# EAGLE schematic Circlez8a (EAGLE 6.3)
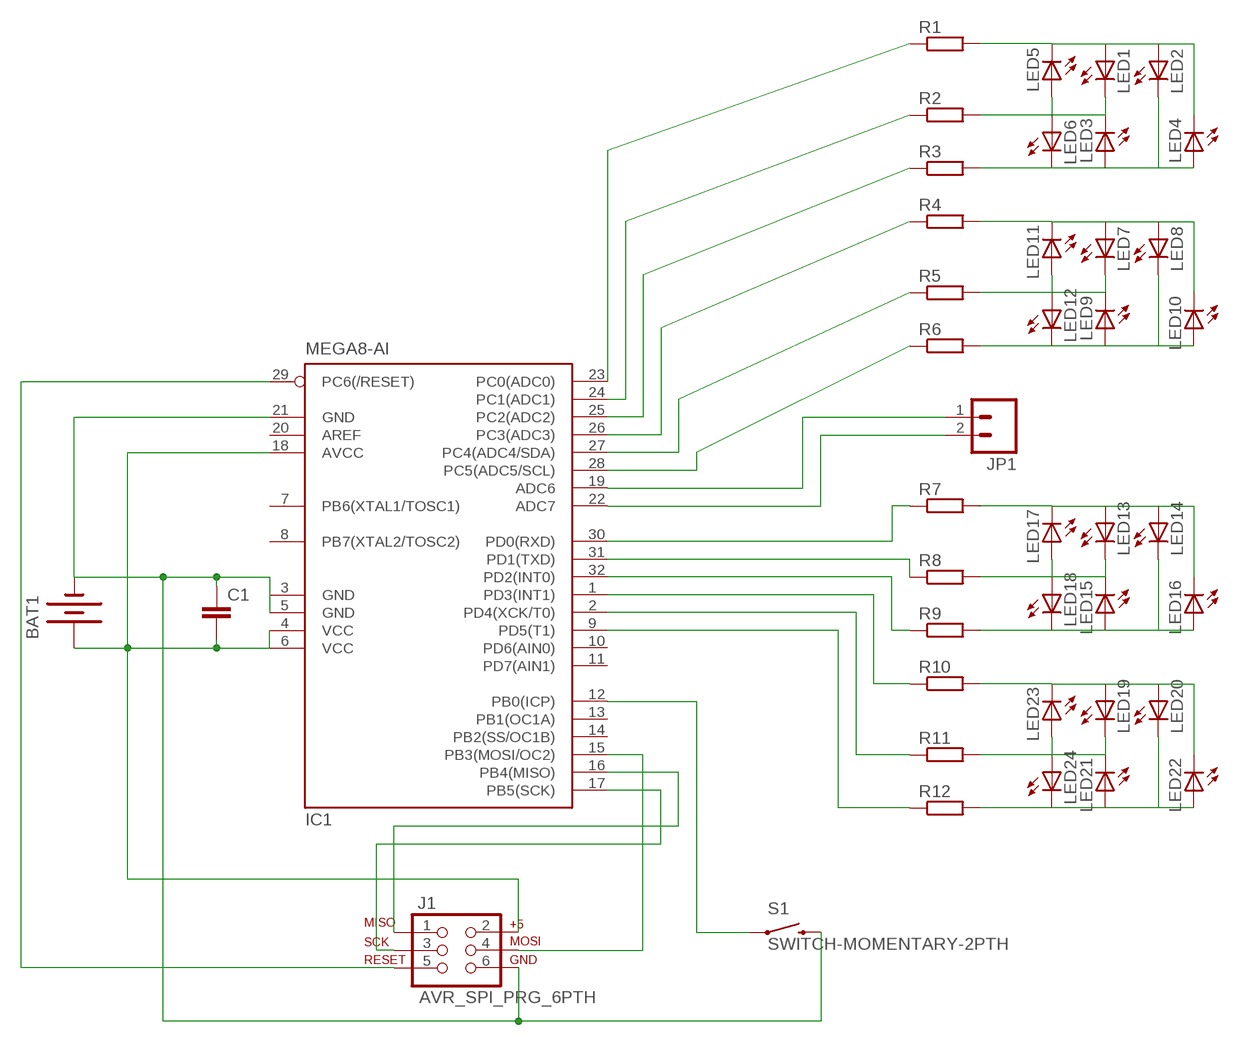
[diagram p0: schematic, sheet 1]

## Parts
BAT1  BATTERY20PTH  [BATTCOM_20MM_PTH]
C1  C-EU025-024X044  [C025-024X044]
IC1  MEGA8-AI  [TQFP32-08]
J1  AVR_SPI_PRG_6PTH  [2X3]
JP1  M02PTH  [1X02]
LED1  LEDCHIPLED_0603  [CHIPLED_0603]
LED2  LEDCHIPLED_0603  [CHIPLED_0603]
LED3  LEDCHIPLED_0603  [CHIPLED_0603]
LED4  LEDCHIPLED_0603  [CHIPLED_0603]
LED5  LEDCHIPLED_0603  [CHIPLED_0603]
LED6  LEDCHIPLED_0603  [CHIPLED_0603]
LED7  LEDCHIPLED_0603  [CHIPLED_0603]
LED8  LEDCHIPLED_0603  [CHIPLED_0603]
LED9  LEDCHIPLED_0603  [CHIPLED_0603]
LED10  LEDCHIPLED_0603  [CHIPLED_0603]
LED11  LEDCHIPLED_0603  [CHIPLED_0603]
LED12  LEDCHIPLED_0603  [CHIPLED_0603]
LED13  LEDCHIPLED_0603  [CHIPLED_0603]
LED14  LEDCHIPLED_0603  [CHIPLED_0603]
LED15  LEDCHIPLED_0603  [CHIPLED_0603]
LED16  LEDCHIPLED_0603  [CHIPLED_0603]
LED17  LEDCHIPLED_0603  [CHIPLED_0603]
LED18  LEDCHIPLED_0603  [CHIPLED_0603]
LED19  LEDCHIPLED_0603  [CHIPLED_0603]
LED20  LEDCHIPLED_0603  [CHIPLED_0603]
LED21  LEDCHIPLED_0603  [CHIPLED_0603]
LED22  LEDCHIPLED_0603  [CHIPLED_0603]
LED23  LEDCHIPLED_0603  [CHIPLED_0603]
LED24  LEDCHIPLED_0603  [CHIPLED_0603]
R1  R-EU_R1206  [R1206]
R2  R-EU_R1206  [R1206]
R3  R-EU_R1206  [R1206]
R4  R-EU_R1206  [R1206]
R5  R-EU_R1206  [R1206]
R6  R-EU_R1206  [R1206]
R7  R-EU_R1206  [R1206]
R8  R-EU_R1206  [R1206]
R9  R-EU_R1206  [R1206]
R10  R-EU_R1206  [R1206]
R11  R-EU_R1206  [R1206]
R12  R-EU_R1206  [R1206]
S1  SWITCH-MOMENTARY-2PTH  [TACTILE-PTH]

## Nets
GND: BAT1.2(-) C1.1 IC1.3(GND) IC1.5(GND) IC1.21(GND) J1.6 S1.3
N$1: IC1.12(PB0(ICP)) S1.1
N$3: IC1.16(PB4(MISO)) J1.1
N$4: IC1.17(PB5(SCK)) J1.3
N$5: IC1.15(PB3(MOSI/OC2)) J1.4
N$6: IC1.29(PC6(/RESET)) J1.5
N$9: LED1.A LED2.A LED4.C LED5.C R1.2
N$10: LED2.C LED3.A LED4.A LED6.C R3.2
N$11: LED1.C LED3.C LED5.A LED6.A R2.2
N$12: IC1.22(ADC7) JP1.2
N$13: LED7.A LED8.A LED10.C LED11.C R4.2
N$14: LED8.C LED9.A LED10.A LED12.C R6.2
N$15: LED7.C LED9.C LED11.A LED12.A R5.2
N$16: LED13.A LED14.A LED16.C LED17.C R7.2
N$17: LED14.C LED15.A LED16.A LED18.C R9.2
N$18: LED13.C LED15.C LED17.A LED18.A R8.2
N$19: LED19.A LED20.A LED22.C LED23.C R10.2
N$20: LED20.C LED21.A LED22.A LED24.C R12.2
N$21: LED19.C LED21.C LED23.A LED24.A R11.2
N$22: IC1.23(PC0(ADC0)) R1.1
N$23: IC1.24(PC1(ADC1)) R2.1
N$24: IC1.25(PC2(ADC2)) R3.1
N$25: IC1.26(PC3(ADC3)) R4.1
N$26: IC1.27(PC4(ADC4/SDA)) R5.1
N$27: IC1.28(PC5(ADC5/SCL)) R6.1
N$28: IC1.30(PD0(RXD)) R7.1
N$29: IC1.31(PD1(TXD)) R8.1
N$30: IC1.32(PD2(INT0)) R9.1
N$31: IC1.1(PD3(INT1)) R10.1
N$32: IC1.2(PD4(XCK/T0)) R11.1
N$33: IC1.9(PD5(T1)) R12.1
N$34: IC1.19(ADC6) JP1.1
VCC: BAT1.1(+) C1.2 IC1.4(VCC) IC1.6(VCC) IC1.18(AVCC) J1.2
Unconnected: IC1.7(PB6(XTAL1/TOSC1)) IC1.8(PB7(XTAL2/TOSC2)) IC1.10(PD6(AIN0)) IC1.11(PD7(AIN1)) IC1.13(PB1(OC1A)) IC1.14(PB2(SS/OC1B)) IC1.20(AREF)

## Library data of the parts
BAT1 = SparkFun:BATTERY: Battery Holders Various common sizes : AA, AAA, 20mm coin cell and 12mm coin cell.
C1 = resistor:C-EU: CAPACITOR, European symbol
IC1 = atmel:MEGA8: MICROCONTROLLER 8 Kbytes FLASH, 1 kbytes SRAM, 512 bytes EEPROM, USART, 6-channel 10 bit ADC, 2-channel 8 bit ADC Pin compatible with Atmega48, ATMega88, ATMega168 Source: avr.lbr; MPN: ATMEGA8-16AU; OC_FARNELL: 9171371; OC_NEWARK: 73M8863
J1 = SparkFun-Connectors:AVR_SPI_PRG_6: AVR ISP 6 Pin This is the reduced ISP connector for AVR programming. Common on Arduino. This footprint will take up less PCB space and can be used with a 10-pin to 6-pin adapter such as SKU: BOB-08508
JP1 = SparkFun-Connectors:M02: Header 2 Standard 2-pin 0.1" header. Use with straight break away headers (SKU : PRT-00116), right angle break away headers (PRT-00553), swiss pins (PRT-00743), machine pins (PRT-00117), and female headers (PRT-00115). Molex polarized connector foot print use with SKU : PRT-08233 with associated crimp pins and housings.
LED1-LED24 = led:LED: LED OSRAM: - CHIPLED LG R971, LG N971, LY N971, LG Q971, LY Q971, LO R971, LY R971 LH N974, LH R974 LS Q976, LO Q976, LY Q976 LO Q996 - Hyper CHIPLED LW Q18S LB Q993, LB Q99A, LB R99A - SideLED LS A670, LO A670, LY A670, LG A670, LP A670 LB A673, LV A673, LT A673, LW A673 LH A674 LY A675 LS A676, LA A676, LO A676, LY A676, LW A676 LS A679, LY A679, LG A679 - Hyper Micro SIDELED® LS Y876, LA Y876, LO Y876, LY Y876 LT Y87S - SmartLED LW L88C, LW L88S LB L89C, LB L89S, LG L890 LS L89K, LO L89K, LY L89K LS L896, LA L896, LO L896, LY L896 - TOPLED LS T670, LO T670, LY T670, LG T670, LP T670 LSG T670, LSP T670, LSY T670, LOP T670, LYG T670 LG T671, LOG T671, LSG T671 LB T673, LV T673, LT T673, LW T673 LH T674 LS T676, LA T676, LO T676, LY T676, LB T676, LH T676, LSB T676, LW T676 LB T67C, LV T67C, LT T67C, LS T67K, LO T67K, LY T67K, LW E67C LS E67B, LA E67B, LO E67B, LY E67B, LB E67C, LV E67C, LT E67C LW T67C LS T679, LY T679, LG T679 LS T770, LO T770, LY T770, LG T770, LP T770 LB T773, LV T773, LT T773, LW T773 LH T774 LS E675, LA E675, LY E675, LS T675 LS T776, LA T776, LO T776, LY T776, LB T776 LHGB T686 LT T68C, LB T68C - Hyper Mini TOPLED® LB M676 - Mini TOPLED Santana® LG M470 LS M47K, LO M47K, LY M47K Source: http://www.osram.convergy.de LUXEON: - LUMILED® LXK2-PW12-R00, LXK2-PW12-S00, LXK2-PW14-U00, LXK2-PW14-V00 LXK2-PM12-R00, LXK2-PM12-S00, LXK2-PM14-U00 LXK2-PE12-Q00, LXK2-PE12-R00, LXK2-PE12-S00, LXK2-PE14-T00, LXK2-PE14-U00 LXK2-PB12-K00, LXK2-PB12-L00, LXK2-PB12-M00, LXK2-PB14-N00, LXK2-PB14-P00, LXK2-PB14-Q00 LXK2-PR12-L00, LXK2-PR12-M00, LXK2-PR14-Q00, LXK2-PR14-R00 LXK2-PD12-Q00, LXK2-PD12-R00, LXK2-PD12-S00 LXK2-PH12-R00, LXK2-PH12-S00 LXK2-PL12-P00, LXK2-PL12-Q00, LXK2-PL12-R00 Source: www.luxeon.com KINGBRIGHT: KA-3528ASYC Source: www.kingbright.com
R1-R12 = resistor:R-EU_: RESISTOR, European symbol
S1 = SparkFun-Electromechanical:SWITCH-MOMENTARY-2: Various NO switches- pushbuttons, reed, etc